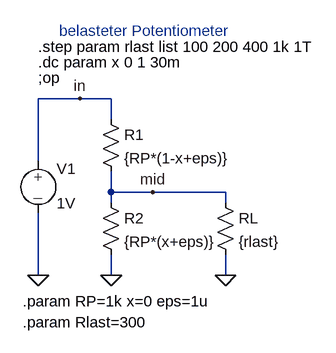
[diagram p0: schematic poti.asc]
poti.asc, the LTspice schematic file:
Version 4
SHEET 1 880 680
WIRE 96 48 32 48
WIRE 144 48 96 48
WIRE 144 80 144 48
WIRE 32 144 32 48
WIRE 144 192 144 160
WIRE 208 192 144 192
WIRE 320 192 208 192
WIRE 144 208 144 192
WIRE 320 208 320 192
WIRE 32 320 32 224
WIRE 144 320 144 288
WIRE 320 320 320 288
FLAG 144 320 0
FLAG 32 320 0
FLAG 208 192 mid
FLAG 96 48 in
FLAG 320 320 0
SYMBOL res 128 64 R0
SYMATTR InstName R1
SYMATTR Value {RP*(1-x+eps)}
SYMBOL res 128 192 R0
SYMATTR InstName R2
SYMATTR Value {RP*(x+eps)}
SYMBOL source-V 32 128 R0
SYMATTR InstName V1
SYMATTR Value 1V
SYMBOL res 304 192 R0
SYMATTR InstName RL
SYMATTR Value {rlast}
TEXT 32 16 Left 2 !;op
TEXT 8 360 Left 2 !.param RP=1k x=0 eps=1u
TEXT 32 -8 Left 2 !.dc param x 0 1 30m
TEXT 8 392 Left 2 !.param Rlast=300
TEXT 32 -32 Left 2 !.step param rlast list 100 200 400 1k 1T
TEXT 64 -56 Left 2 ;belasteter Potentiometer

The netlist it stands for:
* poti.asc
R1 in mid {RP*(1-x+eps)}
R2 mid 0 {RP*(x+eps)}
V1 in 0 1V
RL mid 0 {rlast}
;op
.param RP=1k x=0 eps=1u
.dc param x 0 1 30m
.param Rlast=300
.step param rlast list 100 200 400 1k 1T
* belasteter Potentiometer
.backanno
.end